# Altium schematic sheet RcMPPT-BMS-BFE.SchDoc: RcMPPT-BMS-BFE
size A4; Author: Thomas Hofmann; CompanyName: HTL St. Pölten; DocumentNumber: 4; Revision: 2.0; SheetNumber: 4; SheetTotal: 5
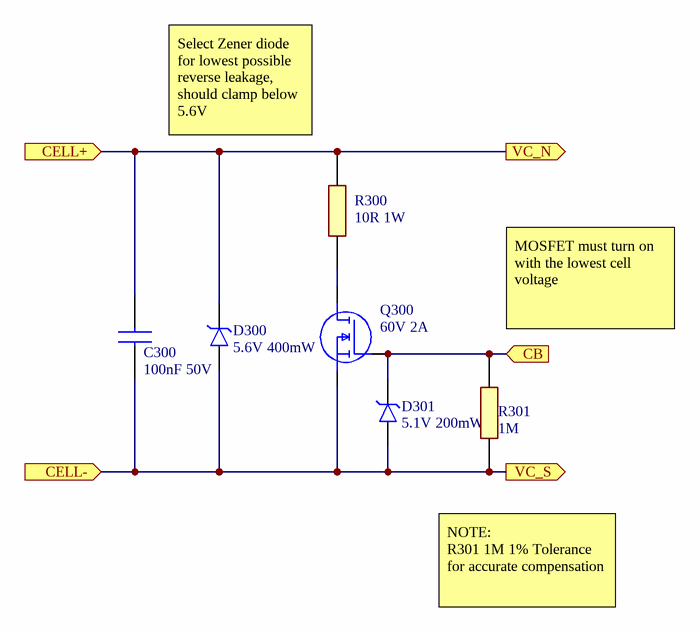
[diagram p0: RcMPPT-BMS-BFE.SchDoc]

## Parts
C300  100nF 50V  [CAPC1608X97N]
D300  5.6V 400mW  [SOD-123FL]
D301  5.1V 200mW  [SOD-323]
Q300  60V 2A  [SOT96P240X110-3N]
R300  10R 1W  [RESC6331X75N]
R301  1M  [RESC1005X40N]

## Ports
CB (in), CELL+ (in), CELL- (in), VC_N (out), VC_S (out)

## Nets
CB: D301.1(K) Q300.1(G) R301.2 ; port CB
CELL+: C300.2 D300.1(K) R300.2 ; port CELL+, port VC_N
CELL-: C300.1 D300.2(A) D301.2(A) Q300.2(S) R301.1 ; port VC_S, port CELL-
NetQ300_3: Q300.3(D) R300.1

## Notes on the sheet
- (near R300) Select Zener diode for lowest possible reverse leakage, should clamp below 5.6V
- (near R301) MOSFET must turn on with the lowest cell voltage
- NOTE:
  R301 1M 1% Tolerance
  for accurate compensation
- Title
- Size:
- Date:
- A4
- Number:
- Time:
- Revision:
- Sheet
- of
- RcMPPT
- File:

## Library data of the parts
C300 = C0603: Capacitor; Height: 0.97
D300 D301 = ZENER-DIODE: ZENER Diode
Q300 = NMOS: MOSFET (N-Channel)
R300 = R2512: Resistor; Height: 0.75mm
R301 = R0402: Resistor; Height: 0.4mm